# EAGLE design minimatrix (EAGLE 6.2)
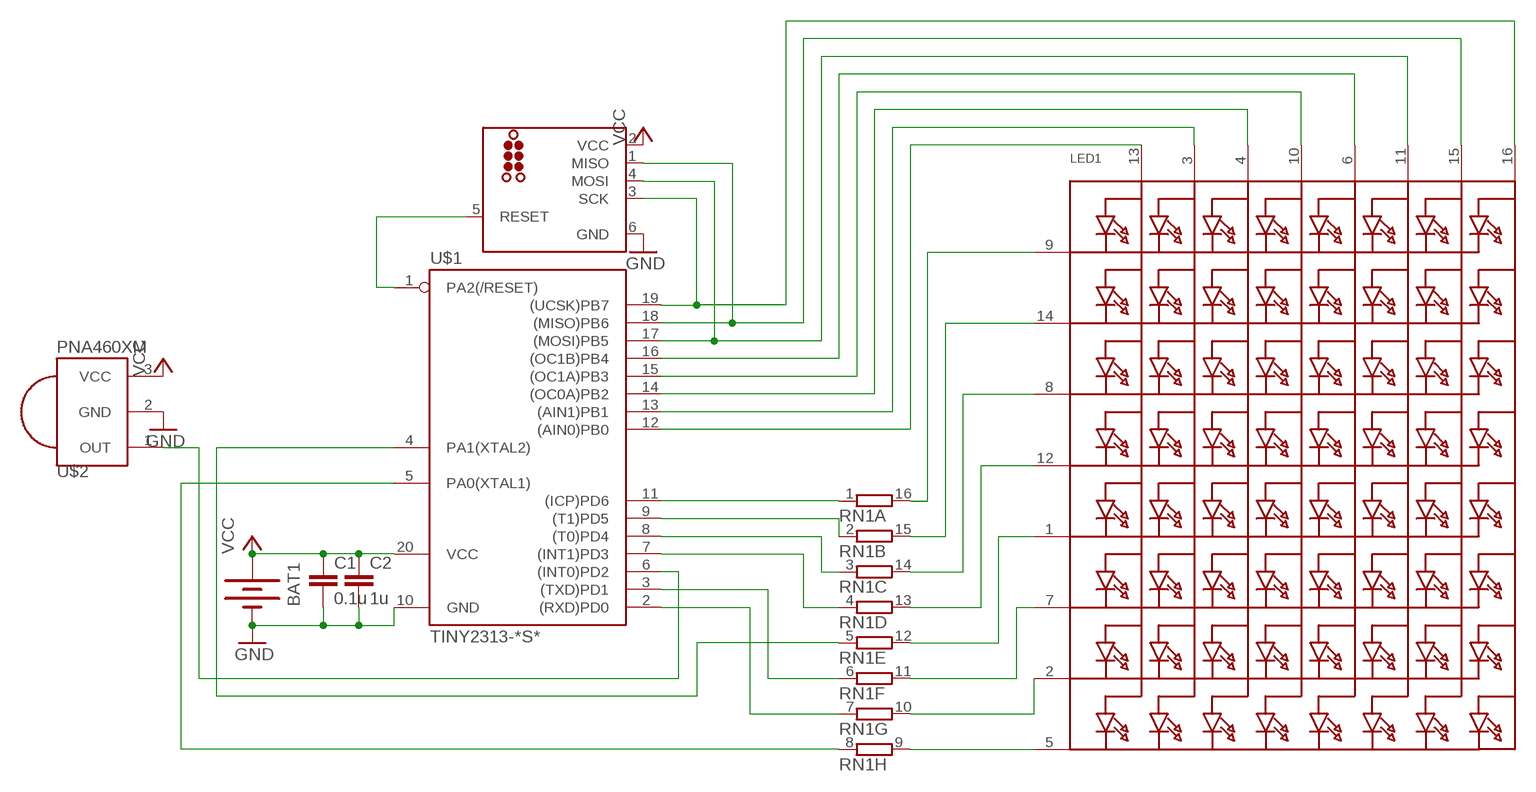
[diagram p0: schematic, sheet 1]

## Parts
BAT1  BATTERY20MM_4LEGS  [BATTCON_20MM_4LEGS]
C1  0.1u  CAP0805  [0805]
C2  1u  CAP0805  [0805]
LED1  SEGMENT_8X8_ROWCATHODEM12A881UR  [SEGMENT_BL-M12A881UR]
RN1  8R-NEXB2HV  [EXB2HV]
U$1  TINY2313-*S*  [SO20L$]
U$2  PNA460XM  [PNA460XM]
U$3  TC2030_AVRMCP-NL  [TC2030-MCP-NL]

## Nets
C1: LED1.13(A1) U$1.12((AIN0)PB0)
C2: LED1.3(A2) U$1.13((AIN1)PB1)
C3: LED1.4(A3) U$1.14((OC0A)PB2)
C4: LED1.10(A4) U$1.15((OC1A)PB3)
C5: LED1.6(A5) U$1.16((OC1B)PB4)
C6: LED1.11(A6) U$1.17((MOSI)PB5) U$3.4(MOSI)
C7: LED1.15(A7) U$1.18((MISO)PB6) U$3.1(MISO)
C8: LED1.16(A8) U$1.19((UCSK)PB7) U$3.3(SCK)
GND: BAT1.2(-) C1.2 C2.2 U$1.10(GND) U$2.2(GND) U$3.6(GND)
N$1: U$1.6((INT0)PD2) U$2.1(OUT)
N$2: U$1.1(PA2(/RESET)) U$3.5(RESET)
N$3: RN1.5 U$1.4(PA1(XTAL2))
R1: RN1.1 U$1.11((ICP)PD6)
R2: RN1.2 U$1.9((T1)PD5)
R3: RN1.3 U$1.8((T0)PD4)
R4: RN1.4 U$1.7((INT1)PD3)
R6: RN1.6 U$1.3((TXD)PD1)
R7: RN1.7 U$1.2((RXD)PD0)
R8: RN1.8 U$1.5(PA0(XTAL1))
ROW1: LED1.9(K1) RN1.16
ROW2: LED1.14(K2) RN1.15
ROW3: LED1.8(K3) RN1.14
ROW4: LED1.12(K4) RN1.13
ROW5: LED1.1(K5) RN1.12
ROW6: LED1.7(K6) RN1.11
ROW7: LED1.2(K7) RN1.10
ROW8: LED1.5(K8) RN1.9
VCC: BAT1.1(+) C1.1 C2.1 U$1.20(VCC) U$2.3(VCC) U$3.2(VCC)

## Library data of the parts
BAT1 = SparkFun-Electromechanical:BATTERY: Battery Holders Various common sizes : AA, AAA, 20mm coin cell and 12mm coin cell.
C1 C2 = SparkFun-Passives:CAP: Capacitor Standard 0603 ceramic capacitor, and 0.1" leaded capacitor.
LED1 = adafruit:SEGMENT_8X8_ROWCATHODE: 8x8 LED Segment Displays: Row = Cathode 0.7" Red 8X8 Matrix, 1.9mm Round LEDs - BL-M07C881UR 1.2" Red 8x8 Matrix, 3.0mm Round LEDs - BL-M12A881UR 1.2" Red 8x8 Matrix, 3.0mm Square LEDs - BL-M12A883
RN1 = resistor-dil:8R-N: DIL RESISTOR; OC_FARNELL: unknown; OC_NEWARK: unknown
U$1 = avr-7:TINY2313*: Atmel Tiny2313 2K Flash, 128 bytes EEPROM, 128 bytes RAM
U$2 = adafruit:PNA460XM: IR 38KHz receiver PNA4602 and related receivers http://www.ladyada.net/library/pcb/eaglelibrary.html
U$3 = tag-connect:TC2030_AVR

## Board
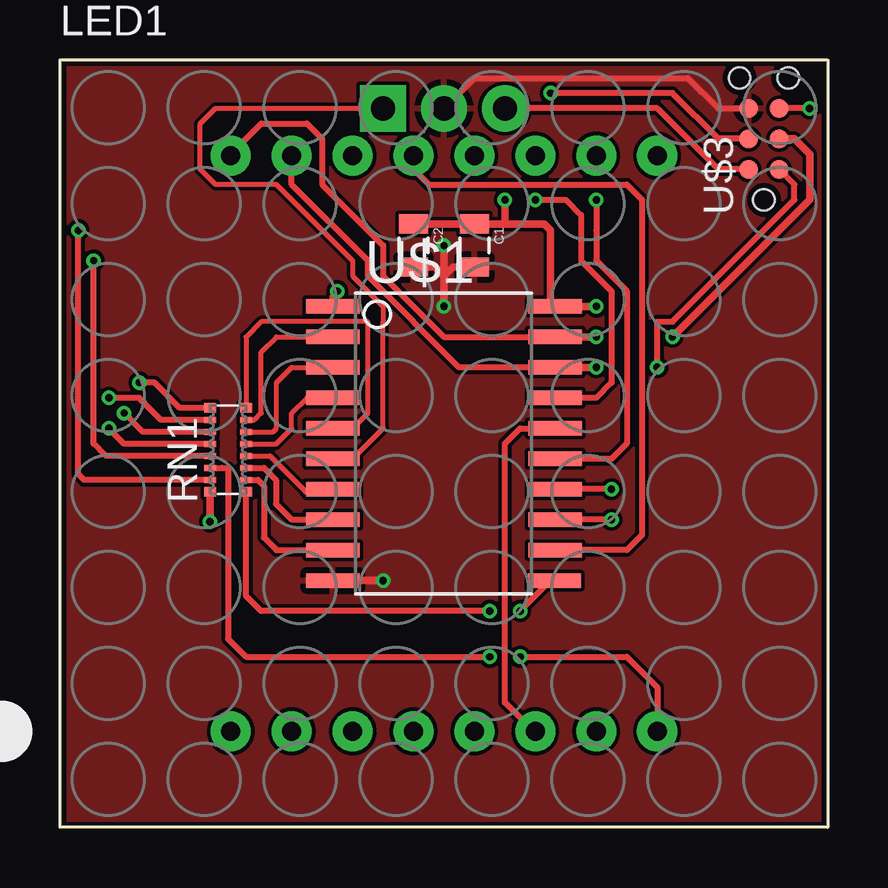
[diagram p1: board, top side]
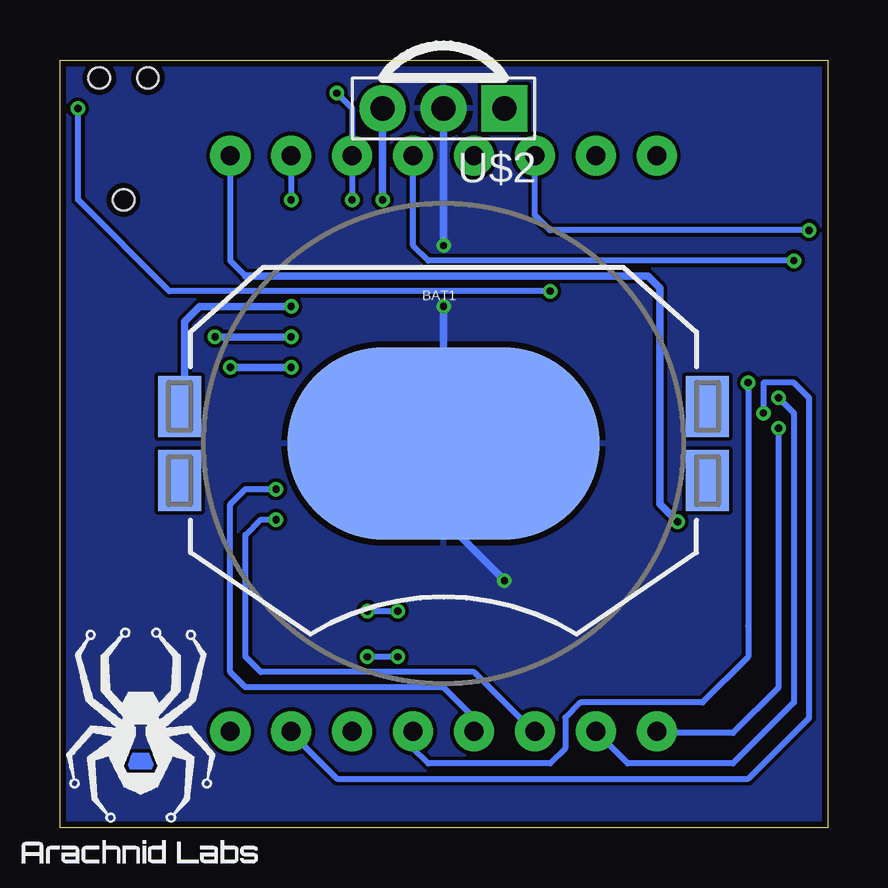
[diagram p2: board, bottom side, seen from below]

Size 32 x 32 mm. Coordinates in mm from the lower left corner, seen from the top.
Outline: 0,0 32,0 32,32 0,32 0,0
Copper layers (1*16): Top 0.035mm / dielectric 1.5mm / Bottom 0.035mm
Design rules: minimum track width 6mil, minimum drill 0.3mm, track to track 6mil, track to pad 6mil, pad to pad 6mil, via to via 6mil, smd to smd 0mil, copper to edge 10mil, drill to drill 10mil, minimum pad ring 10mil, minimum via ring 6mil, stop-mask expansion 2mil, vias tented up to drill 100mil, thermal gap 10mil

### Footprints (pad centres in the part's own frame; a part is rotated, then mirrored left to right if it is on the bottom)
BATTCON_20MM_4LEGS = smd 1.778 x 2.54: 1 -11,1.55; 3 11,1.55; P$1 -11,-1.55; P$2 11,-1.55 | smd 13 x 8: 2 0,0
0805 = smd 0.8 x 1.2: 1 -0.9,0; 2 0.9,0
SEGMENT_BL-M12A881UR = drill 0.8 pad 1.676: 1 -8.89,-12; 2 -6.35,-12; 3 -3.81,-12; 4 -1.27,-12; 5 1.27,-12; 6 3.81,-12; 7 6.35,-12; 8 8.89,-12; 9 8.89,12; 10 6.35,12; 11 3.81,12; 12 1.27,12; 13 -1.27,12; 14 -3.81,12; 15 -6.35,12; 16 -8.89,12
EXB2HV = smd 0.38 x 0.5: 1 -1.75,-0.75; 8 1.75,-0.75; 9 1.75,0.75; 16 -1.75,0.75 | smd 0.25 x 0.5: 2 -1.25,-0.75; 3 -0.75,-0.75; 4 -0.25,-0.75; 5 0.25,-0.75; 6 0.75,-0.75; 7 1.25,-0.75; 10 1.25,0.75; 11 0.75,0.75; 12 0.25,0.75; 13 -0.25,0.75; 14 -0.75,0.75; 15 -1.25,0.75
SO20L$ = smd 0.61 x 2.21: 1 -5.715,-4.636; 2 -4.445,-4.636; 3 -3.175,-4.636; 4 -1.905,-4.636; 5 -0.635,-4.636; 6 0.635,-4.636; 7 1.905,-4.636; 8 3.175,-4.636; 9 4.445,-4.636; 10 5.715,-4.636; 11 5.715,4.61; 12 4.445,4.636; 13 3.175,4.636; 14 1.905,4.636; 15 0.635,4.636; 16 -0.635,4.636; 17 -1.905,4.636; 18 -3.175,4.636; 19 -4.445,4.636; 20 -5.715,4.636
PNA460XM = drill 1.016 pad 1.93 square: 1 -2.54,0 | drill 1.016 pad 1.93: 2 0,0; 3 2.54,0
TC2030-MCP-NL = smd 0.787 x 0.787: 1 1.27,-0.635; 2 1.27,0.635; 3 2.54,-0.635; 4 2.54,0.635; 5 3.81,-0.635; 6 3.81,0.635 | hole 0.889: 0,0; 5.08,-1.016; 5.08,1.016

### Placement (x,y rotation side)
BAT1  16.01,16.01 0 bottom
C1  17.28,24.27 270 top
C2  14.74,24.27 270 top
LED1  16.01,16.01 0 top
RN1  7,15.75 90 top
U$1  16.01,16.01 270 top
U$2  16.01,29.98 180 bottom
U$3  29.34,26.17 90 top
U$4  [ARACHNID_LABS_LOGO_SM]  28.67,3.43 0 bottom

### Tracks (layer width: path | path; a pad name or v marks a point on that pad's centre or on a via)
C1
  Top 0.254: LED1.13 14.74,27.44 15.38,26.8 23.63,26.8 24.27,26.17 24.27,12.2 23.63,11.56 U$1.12
C2  (via drill 0.3)
  Top 0.254: v23,12.84 U$1.13
  Bottom 0.254: LED1.3 12.27,4.01 14.74,6.49 23.63,6.49 24.27,7.12 24.27,12.2 23.63,12.84 v23,12.84
C3  (via drill 0.3)
  Top 0.254: v23,14.11 U$1.14
  Bottom 0.254: LED1.4 14.74,4.58 16.01,5.85 24.27,5.85 24.9,6.49 24.9,13.47 24.27,14.11 v23,14.11
C4  (via drill 0.3)
  Top 0.254: v22.36,26.17 22.36,24.9 22.36,23.63 23.63,22.36 23.63,16.01 23,15.38 U$1.15
  Bottom 0.254: LED1.10 v22.36,26.17
C5
  Top 0.254: LED1.6 19.75,4.01 18.55,5.21 18.55,16.01 19.18,16.64 U$1.16
C6  (via drill 0.3)
  Top 0.254: v19.82,26.17 21.09,26.17 21.73,25.54 21.73,23.63 23,22.36 23,18.55 22.36,17.91 U$1.17 | U$3.4 27.44,28.71 25.54,30.61 v20.45,30.61
  Bottom 0.254: v19.82,26.17 LED1.11 19.82,29.98 v20.45,30.61
C7  (via drill 0.3)
  Top 0.254: U$1.18 16.64,19.18 12.84,23 12.84,23.63 9.66,26.8 LED1.15 | v24.9,19.18 24.9,21.09 25.54,21.09 30.61,26.17 30.61,26.8 U$3.1
  Top 0.305: U$1.18 v22.36,19.18
  Bottom 0.305: v22.36,19.18 v24.9,19.18
C8  (via drill 0.3)
  Top 0.254: LED1.16 7.12,28.07 8.39,29.34 10.29,29.34 10.93,28.71 10.93,26.8 13.47,24.27 13.47,23 16.01,20.45 U$1.19
  Top 0.305: U$1.19 v22.36,20.45 | v25.54,20.45 31.25,26.17 31.25,28.07 30.61,28.71 U$3.3
  Bottom 0.305: v22.36,20.45 v25.54,20.45
GND  (via drill 0.3)
  Top 0.254: U$2.2 17.28,31.25 26.17,31.25 27.44,29.98 U$3.6
  Top 0.305: v13.47,10.29 U$1.10 | C1.2 16.38,23.36 16.01,23 | 16.01,23 v16.01,21.73 | C2.2 15.64,23.36 16.01,23 | v16.01,24.27 16.01,23
  Bottom 0.305: v13.47,10.29 16.01,12.84 BAT1.2 v16.01,21.73 | U$2.2 v16.01,24.27
  pour Top: 0,32 32,32 32,0 0,0
  pour Bottom: 0,32 32,32 32,0 0,0
N$1
  Top 0.203: U$1.6 12.2,15.38 13.47,16.64 13.47,21.09 13.47,21.73 12.2,23 12.2,23.63 9.66,26.17 9.03,26.8 6.49,26.8 5.85,27.44 5.85,29.34 6.49,29.98 U$2.1
N$2  (via drill 0.3)
  Top 0.254: U$1.1 11.37,22.17 v11.56,22.36 | v31.25,29.98 U$3.5
  Bottom 0.254: v11.56,22.36 27.44,22.36 31.25,26.17 v31.25,29.98
N$3
  Top 0.203: RN1.5 9.02,16 9.66,16.64 9.66,17.28 10.29,17.91 U$1.4
R1  (via drill 0.3)
  Top 0.254: U$1.11 20.45,10.29 v19.18,9.03 | v17.91,9.03 8.39,9.03 7.76,9.66 RN1.1
  Bottom 0.254: v19.18,9.03 v17.91,9.03
R2
  Top 0.254: RN1.2 8.25,14.5 8.5,14.25 8.5,12.09 9.03,11.56 U$1.9
R3
  Top 0.254: RN1.3 8.5,15 9,14.5 9,13.49 9.66,12.84 U$1.8
R4
  Top 0.203: RN1.4 8.75,15.5 10.25,14
  Top 0.254: 10.25,14 11.27,14 U$1.7
R6
  Top 0.203: RN1.6 8.88,16.5 9.03,16.64 9.03,18.55 9.66,19.18 U$1.3
R7
  Top 0.203: RN1.7 8.11,17 8.39,17.28 8.39,19.82 9.03,20.45 U$1.2
R8
  Top 0.203: U$1.5 12.2,16.64 12.84,17.28 12.84,19.82 12.84,21.09 8.39,21.09 7.76,20.45 RN1.8
ROW1  (via drill 0.3)
  Top 0.305: v6.25,12.75 RN1.16
  Bottom 0.254: LED1.9 24.9,23.63 24.27,23
  Bottom 0.305: 24.27,23 7.5,23 7,22.5 7,13.5 v6.25,12.75
ROW2  (via drill 0.3)
  Top 0.254: RN1.15 1.01,14.5 0.77,14.74 v0.77,24.9
  Bottom 0.254: v0.77,24.9 11.56,24.9 12.2,25.54 LED1.14
ROW3  (via drill 0.3)
  Top 0.254: RN1.14 6.75,15 7,15 7,7.88 7.76,7.12 v17.91,7.12 | v19.18,7.12 23.63,7.12 24.9,5.85 LED1.8
  Bottom 0.254: v17.91,7.12 v19.18,7.12
ROW4  (via drill 0.3)
  Top 0.254: RN1.13 1.92,15.5 1.41,16.01 v1.41,23.63
  Bottom 0.254: v1.41,23.63 16.64,23.63 17.28,24.27 LED1.12
ROW5  (via drill 0.3)
  Top 0.254: RN1.12 2.69,16 v2.04,16.64
  Bottom 0.254: LED1.1 7.05,3.95 3.95,3.95 2.04,5.85 v2.04,16.64
ROW6  (via drill 0.3)
  Top 0.254: RN1.11 3.46,16.5 v2.67,17.28
  Bottom 0.254: LED1.7 22.36,3.95 20.45,2.04 3.31,2.04 0.77,4.58 0.77,17.91 1.41,18.55 2.67,18.55 v2.67,17.28
ROW7  (via drill 0.3)
  Top 0.254: RN1.10 4.22,17 3.31,17.91 v2.04,17.91
  Bottom 0.254: v2.04,17.91 1.41,17.28 1.41,5.21 3.95,2.67 8.32,2.67 LED1.2
ROW8  (via drill 0.3)
  Top 0.254: RN1.9 5,17.5 3.95,18.55 v3.31,18.55
  Bottom 0.254: LED1.5 17.28,3.31 16.64,2.67 11.56,2.67 10.93,3.31 10.93,4.58 10.29,5.21 5.21,5.21 3.31,7.12 3.31,8.39 v3.31,18.55
VCC  (via drill 0.3)
  Top 0.254: U$3.2 27.44,27.44 24.9,29.98 U$2.3
  Top 0.305: v22.36,21.73 U$1.20 20.45,21.92 20.45,24.9 20.19,25.16 18.55,25.16 | C2.1 C1.1 18.55,25.16 | v18.55,26.17 18.55,25.16
  Bottom 0.305: 26.38,17.71 27.01,17.71 BAT1.1 26.8,17.77 26.8,21.09 26.17,21.73 v22.36,21.73 | U$2.3 v18.55,26.17